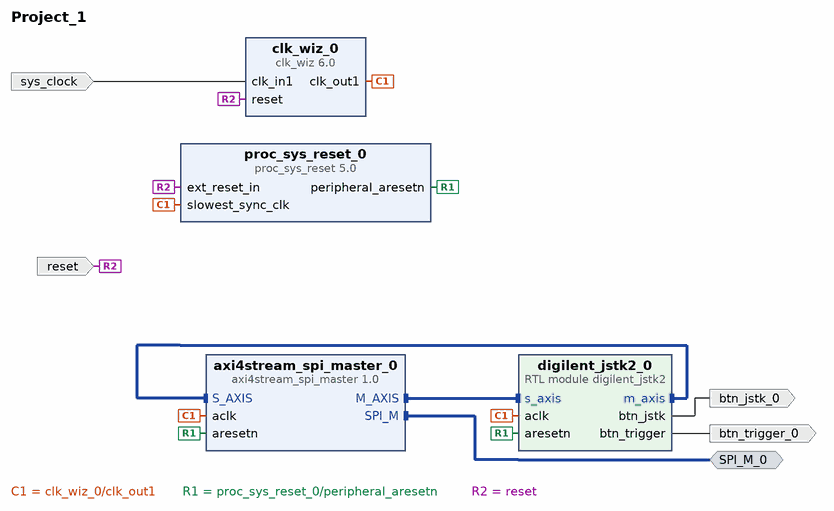
[diagram p0: block diagram of the top level]
# Vivado block design Project_1, xc7a35tcpg236-1, Vivado 2020.2
create_bd_design Project_1

create_bd_intf_port -mode Master -vlnv xilinx.com:interface:spi_rtl:1.0 SPI_M_0
create_bd_port -dir I -type clk sys_clock
set_property -dict {CONFIG.FREQ_HZ 100000000 CONFIG.PHASE 0.000} [get_bd_ports sys_clock]
create_bd_port -dir O btn_jstk_0
create_bd_port -dir O btn_trigger_0
create_bd_port -dir I -type rst reset
set_property -dict {CONFIG.POLARITY ACTIVE_HIGH} [get_bd_ports reset]

create_bd_cell -type ip -vlnv DigiLAB:ip:axi4stream_spi_master:1.0 axi4stream_spi_master_0
create_bd_cell -type ip -vlnv xilinx.com:ip:clk_wiz:6.0 clk_wiz_0
set_property -dict [list \
  CONFIG.CLK_IN1_BOARD_INTERFACE sys_clock \
  CONFIG.RESET_BOARD_INTERFACE reset \
  CONFIG.USE_BOARD_FLOW true \
] [get_bd_cells clk_wiz_0]
create_bd_cell -type ip -vlnv xilinx.com:ip:proc_sys_reset:5.0 proc_sys_reset_0
set_property -dict {CONFIG.RESET_BOARD_INTERFACE reset CONFIG.USE_BOARD_FLOW true} [get_bd_cells proc_sys_reset_0]
create_bd_cell -type module -reference digilent_jstk2 digilent_jstk2_0

# ---- connections ----

connect_bd_intf_net [get_bd_intf_pins digilent_jstk2_0/s_axis] [get_bd_intf_pins axi4stream_spi_master_0/M_AXIS]
connect_bd_intf_net [get_bd_intf_ports SPI_M_0] [get_bd_intf_pins axi4stream_spi_master_0/SPI_M]
connect_bd_intf_net [get_bd_intf_pins axi4stream_spi_master_0/S_AXIS] [get_bd_intf_pins digilent_jstk2_0/m_axis]
connect_bd_net [get_bd_ports sys_clock] [get_bd_pins clk_wiz_0/clk_in1]
connect_bd_net [get_bd_pins clk_wiz_0/clk_out1] \
  [get_bd_pins axi4stream_spi_master_0/aclk] [get_bd_pins proc_sys_reset_0/slowest_sync_clk] \
  [get_bd_pins digilent_jstk2_0/aclk]
connect_bd_net [get_bd_pins proc_sys_reset_0/peripheral_aresetn] [get_bd_pins axi4stream_spi_master_0/aresetn] [get_bd_pins digilent_jstk2_0/aresetn]
connect_bd_net [get_bd_pins digilent_jstk2_0/btn_jstk] [get_bd_ports btn_jstk_0]
connect_bd_net [get_bd_pins digilent_jstk2_0/btn_trigger] [get_bd_ports btn_trigger_0]
connect_bd_net [get_bd_ports reset] [get_bd_pins proc_sys_reset_0/ext_reset_in] [get_bd_pins clk_wiz_0/reset]

validate_bd_design
save_bd_design
